# EAGLE design 7segment (EAGLE 6.6.0)
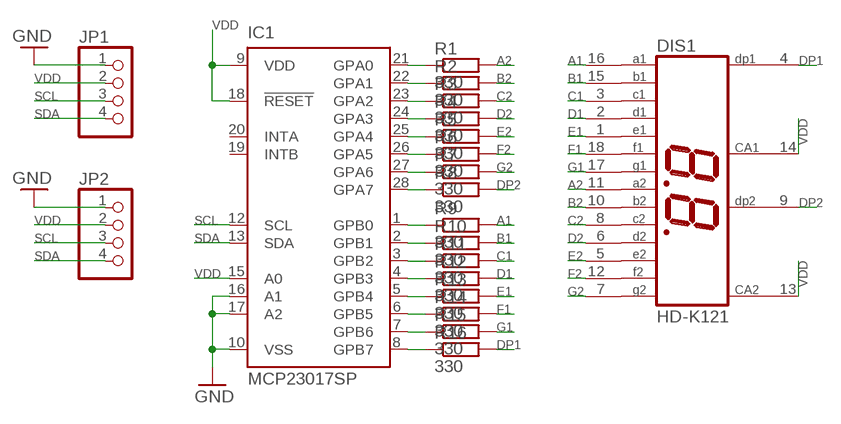
[diagram p0: schematic, sheet 1]

## Parts
DIS1  HD-K121  [HDSP-R]
IC1  MCP23017SP  [DIL28-3]
JP1  PINHD-1X4  [1X04]
JP2  PINHD-1X4  [1X04]
R1  330  R-EU_0204/2V  [0204V]
R2  330  R-EU_0204/2V  [0204V]
R3  330  R-EU_0204/2V  [0204V]
R4  330  R-EU_0204/2V  [0204V]
R5  330  R-EU_0204/2V  [0204V]
R6  330  R-EU_0204/2V  [0204V]
R7  330  R-EU_0204/2V  [0204V]
R8  330  R-EU_0204/2V  [0204V]
R9  330  R-EU_0204/2V  [0204V]
R10  330  R-EU_0204/2V  [0204V]
R11  330  R-EU_0204/2V  [0204V]
R12  330  R-EU_0204/2V  [0204V]
R13  330  R-EU_0204/2V  [0204V]
R14  330  R-EU_0204/2V  [0204V]
R15  330  R-EU_0204/2V  [0204V]
R16  330  R-EU_0204/2V  [0204V]

## Nets
A1: DIS1.16(A1) R9.2
A2: DIS1.11(A2) R1.2
B1: DIS1.15(B1) R10.2
B2: DIS1.10(B2) R2.2
C1: DIS1.3(C1) R11.2
C2: DIS1.8(C2) R3.2
D1: DIS1.2(D1) R12.2
D2: DIS1.6(D2) R4.2
DP1: DIS1.4(DP1) R16.2
DP2: DIS1.9(DP2) R8.2
E1: DIS1.1(E1) R13.2
E2: DIS1.5(E2) R5.2
F1: DIS1.18(F1) R14.2
F2: DIS1.12(F2) R6.2
G1: DIS1.17(G1) R15.2
G2: DIS1.7(G2) R7.2
GND: IC1.10(VSS) IC1.16(A1) IC1.17(A2) JP1.1 JP2.1
N$14: IC1.21(GPA0) R1.1
N$15: IC1.22(GPA1) R2.1
N$16: IC1.23(GPA2) R3.1
N$17: IC1.24(GPA3) R4.1
N$18: IC1.25(GPA4) R5.1
N$19: IC1.26(GPA5) R6.1
N$20: IC1.27(GPA6) R7.1
N$21: IC1.28(GPA7) R8.1
N$22: IC1.1(GPB0) R9.1
N$23: IC1.2(GPB1) R10.1
N$24: IC1.3(GPB2) R11.1
N$25: IC1.4(GPB3) R12.1
N$26: IC1.5(GPB4) R13.1
N$27: IC1.6(GPB5) R14.1
N$28: IC1.7(GPB6) R15.1
N$29: IC1.8(GPB7) R16.1
SCL: IC1.12(SCL) JP1.3 JP2.3
SDA: IC1.13(SDA) JP1.4 JP2.4
VDD: DIS1.13(CA2) DIS1.14(CA1) IC1.9(VDD) IC1.15(A0) IC1.18(!RESET) JP1.2 JP2.2
Unconnected: IC1.19(INTB) IC1.20(INTA)

## Library data of the parts
DIS1 = display-hp:HD-K121: LED DISPLAY 2 x 1 character 7 segment, decimal points right; OC_FARNELL: unknown; OC_NEWARK: unknown
IC1 = microchip:MCP23017: http://ww1.microchip.com/downloads/en/DeviceDoc/21952a.pdf Source: http://ww1.microchip.com/downloads/en/DeviceDoc/21952a.pdf; MF: MICROCHIP; MPN: MCP23017-E/SP; OC_FARNELL: 1332088; OC_NEWARK: 31K2959
JP1 JP2 = pinhead:PINHD-1X4: PIN HEADER
R1-R16 = rcl:R-EU_: RESISTOR, European symbol

## Board
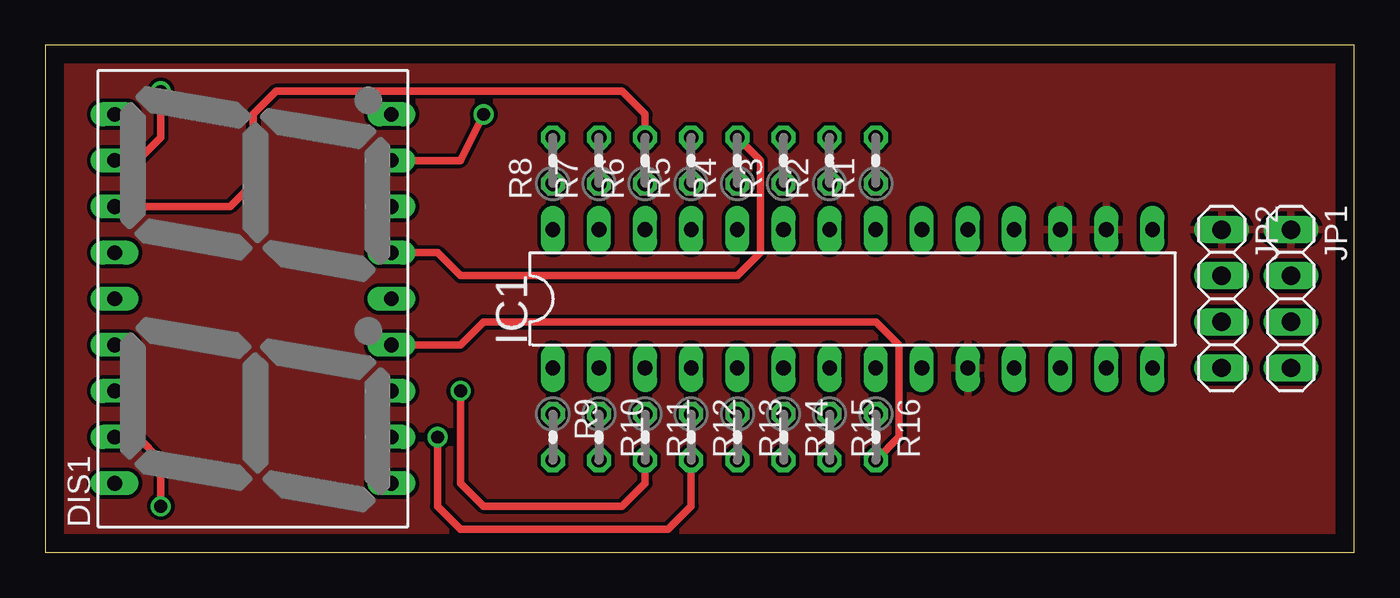
[diagram p1: board, top side]
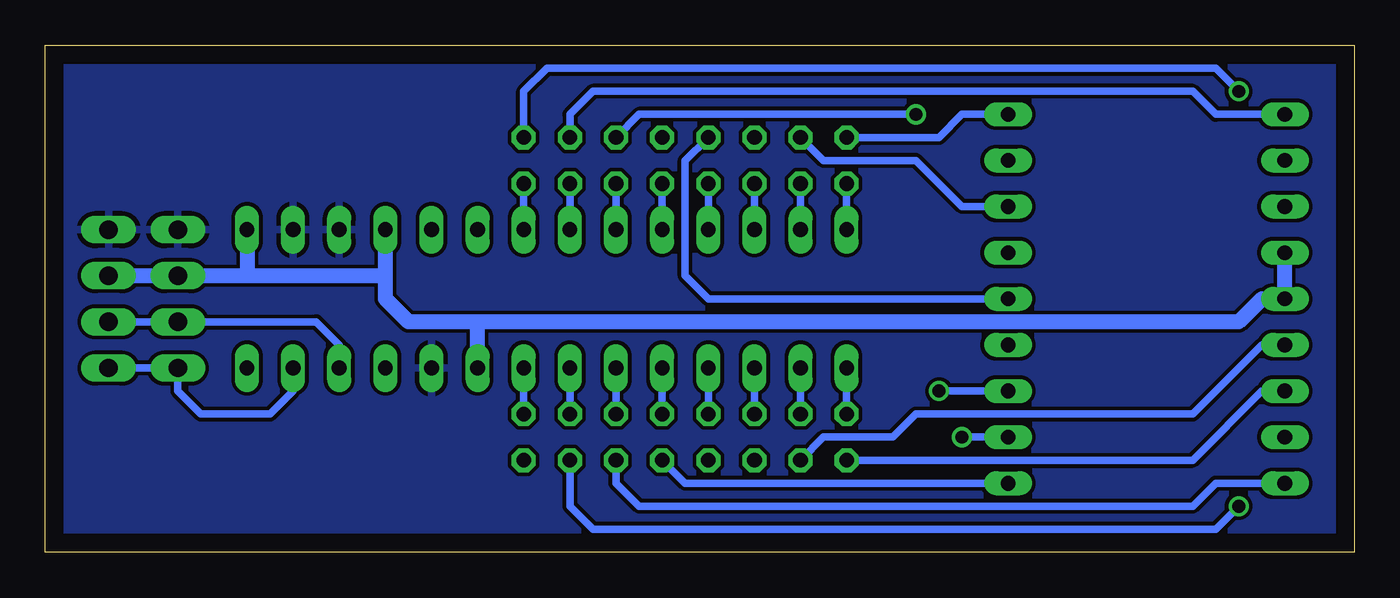
[diagram p2: board, bottom side, seen from below]

Size 72.06 x 27.93 mm. Coordinates in mm from the lower left corner, seen from the top.
Outline: 0,0 72.06,0 72.06,27.93 0,27.93 0,0
Copper layers (1*16): Top 0.035mm / dielectric 1.5mm / Bottom 0.035mm
Design rules "default": minimum track width 10mil, minimum drill 24mil, track to track 8mil, track to pad 8mil, pad to pad 8mil, via to via 8mil, smd to smd 8mil, copper to edge 40mil, drill to drill 8mil, minimum pad ring 10mil, minimum via ring 8mil, stop-mask expansion 4mil, vias tented up to drill 0mil, thermal gap 10mil

### Footprints (pad centres in the part's own frame; a part is rotated, then mirrored left to right if it is on the bottom)
HDSP-R = drill 0.813 long: 1 -10.16,-7.62; 2 -7.62,-7.62; 3 -5.08,-7.62; 4 -2.54,-7.62; 5 0,-7.62; 6 2.54,-7.62; 7 5.08,-7.62; 8 7.62,-7.62; 9 10.16,-7.62; 10 10.16,7.62; 11 7.62,7.62; 12 5.08,7.62; 13 2.54,7.62; 14 0,7.62; 15 -2.54,7.62; 16 -5.08,7.62; 17 -7.62,7.62; 18 -10.16,7.62
DIL28-3 = drill 0.813 long: 1 -16.51,-3.81; 2 -13.97,-3.81; 3 -11.43,-3.81; 4 -8.89,-3.81; 5 -6.35,-3.81; 6 -3.81,-3.81; 7 -1.27,-3.81; 8 1.27,-3.81; 9 3.81,-3.81; 10 6.35,-3.81; 11 8.89,-3.81; 12 11.43,-3.81; 13 13.97,-3.81; 14 16.51,-3.81; 15 16.51,3.81; 16 13.97,3.81; 17 11.43,3.81; 18 8.89,3.81; 19 6.35,3.81; 20 3.81,3.81; 21 1.27,3.81; 22 -1.27,3.81; 23 -3.81,3.81; 24 -6.35,3.81; 25 -8.89,3.81; 26 -11.43,3.81; 27 -13.97,3.81; 28 -16.51,3.81
1X04 = drill 1.016 long: 1 -3.81,0; 2 -1.27,0; 3 1.27,0; 4 3.81,0
0204V = drill 0.813 octagon: 1 -1.27,0; 2 1.27,0

### Placement (x,y rotation side)
DIS1  11.43,13.97 90 top
IC1  44.45,13.97 0 top
JP1  68.58,13.97 270 top
JP2  64.77,13.97 270 top
R1  45.72,21.59 90 top
R2  43.18,21.59 90 top
R3  40.64,21.59 90 top
R4  38.1,21.59 90 top
R5  35.56,21.59 90 top
R6  33.02,21.59 90 top
R7  30.48,21.59 90 top
R8  27.94,21.59 90 top
R9  27.94,6.35 270 top
R10  30.48,6.35 270 top
R11  33.02,6.35 270 top
R12  35.56,6.35 270 top
R13  38.1,6.35 270 top
R14  40.64,6.35 270 top
R15  43.18,6.35 270 top
R16  45.72,6.35 270 top

### Tracks (layer width: path | path; a pad name or v marks a point on that pad's centre or on a via)
A1
  Bottom 0.406: R9.2 8.89,5.08 5.08,8.89 DIS1.16
A2  (via drill 0.7)
  Top 0.406: v6.35,25.4 6.35,22.86 5.08,21.59 DIS1.11
  Bottom 0.406: R1.2 45.72,25.4 44.45,26.67 7.62,26.67 v6.35,25.4
B1
  Bottom 0.406: R10.2 29.21,6.35 25.4,6.35 24.13,7.62 8.89,7.62 5.08,11.43 DIS1.15
B2
  Bottom 0.406: DIS1.10 7.62,24.13 8.89,25.4 41.91,25.4 43.18,24.13 R2.2
C1  (via drill 0.7)
  Top 0.406: v22.86,8.89 22.86,3.81 24.13,2.54 31.75,2.54 33.02,3.81 R11.2
  Bottom 0.406: DIS1.3 v22.86,8.89
C2  (via drill 0.7)
  Top 0.406: DIS1.8 22.86,21.59 v24.13,24.13
  Bottom 0.406: v24.13,24.13 39.37,24.13 R3.2
D1  (via drill 0.7)
  Top 0.406: v21.59,6.35 21.59,2.54 22.86,1.27 34.29,1.27 35.56,2.54 R12.2
  Bottom 0.406: DIS1.2 v21.59,6.35
D2
  Top 0.406: DIS1.6 21.59,16.51 22.86,15.24 38.1,15.24 39.37,16.51 39.37,21.59 R4.2
DP1
  Top 0.406: DIS1.4 22.86,11.43 24.13,12.7 45.72,12.7 46.99,11.43 46.99,6.35 R16.2
DP2
  Bottom 0.406: R8.2 22.86,22.86 21.59,24.13 DIS1.9
E1
  Bottom 0.406: DIS1.1 36.83,3.81 R13.2
E2
  Bottom 0.406: DIS1.5 35.56,13.97 36.83,15.24 36.83,21.59 R5.2
F1
  Bottom 0.406: R14.2 40.64,3.81 39.37,2.54 8.89,2.54 7.62,3.81 DIS1.18
F2
  Top 0.406: DIS1.12 10.16,19.05 11.43,20.32 11.43,24.13 12.7,25.4 31.75,25.4 33.02,24.13 R6.2
G1  (via drill 0.7)
  Top 0.406: DIS1.17 5.08,6.35 6.35,5.08 v6.35,2.54
  Bottom 0.406: R15.2 43.18,2.54 41.91,1.27 7.62,1.27 v6.35,2.54
G2
  Bottom 0.406: DIS1.7 21.59,19.05 24.13,21.59 29.21,21.59 R7.2
GND
  pour Bottom: 0,0 72.39,0 72.39,27.94 0,27.94
  pour Top: 0,0 72.39,0 72.39,27.94 0,27.94
N$14
  Bottom 0.406: R1.1 IC1.21
N$15
  Bottom 0.406: R2.1 IC1.22
N$16
  Bottom 0.406: R3.1 IC1.23
N$17
  Bottom 0.406: R4.1 IC1.24
N$18
  Bottom 0.406: R5.1 IC1.25
N$19
  Bottom 0.406: R6.1 IC1.26
N$20
  Bottom 0.406: R7.1 IC1.27
N$21
  Bottom 0.406: IC1.28 R8.1
N$22
  Bottom 0.406: R9.1 IC1.1
N$23
  Bottom 0.406: R10.1 IC1.2
N$24
  Bottom 0.406: R11.1 IC1.3
N$25
  Bottom 0.406: R12.1 IC1.4
N$26
  Bottom 0.406: R13.1 IC1.5
N$27
  Bottom 0.406: R14.1 IC1.6
N$28
  Bottom 0.406: R15.1 IC1.7
N$29
  Bottom 0.406: R16.1 IC1.8
SCL
  Bottom 0.406: JP1.3 JP2.3 57.15,12.7 55.88,11.43 IC1.12
SDA
  Bottom 0.406: JP1.4 JP2.4 64.77,8.89 63.5,7.62 59.69,7.62 58.42,8.89 IC1.13
VDD
  Bottom 0.813: DIS1.13 DIS1.14 5.08,13.97 6.35,12.7 48.26,12.7 | IC1.9 48.26,12.7 | 48.26,12.7 52.07,12.7 53.34,13.97 53.34,15.24 | 53.34,15.24 IC1.18 | 60.96,15.24 JP2.2 JP1.2 | 60.96,15.24 53.34,15.24 | IC1.15 60.96,15.24